# Altium schematic sheet fmc-interposer.SchDoc
size A3
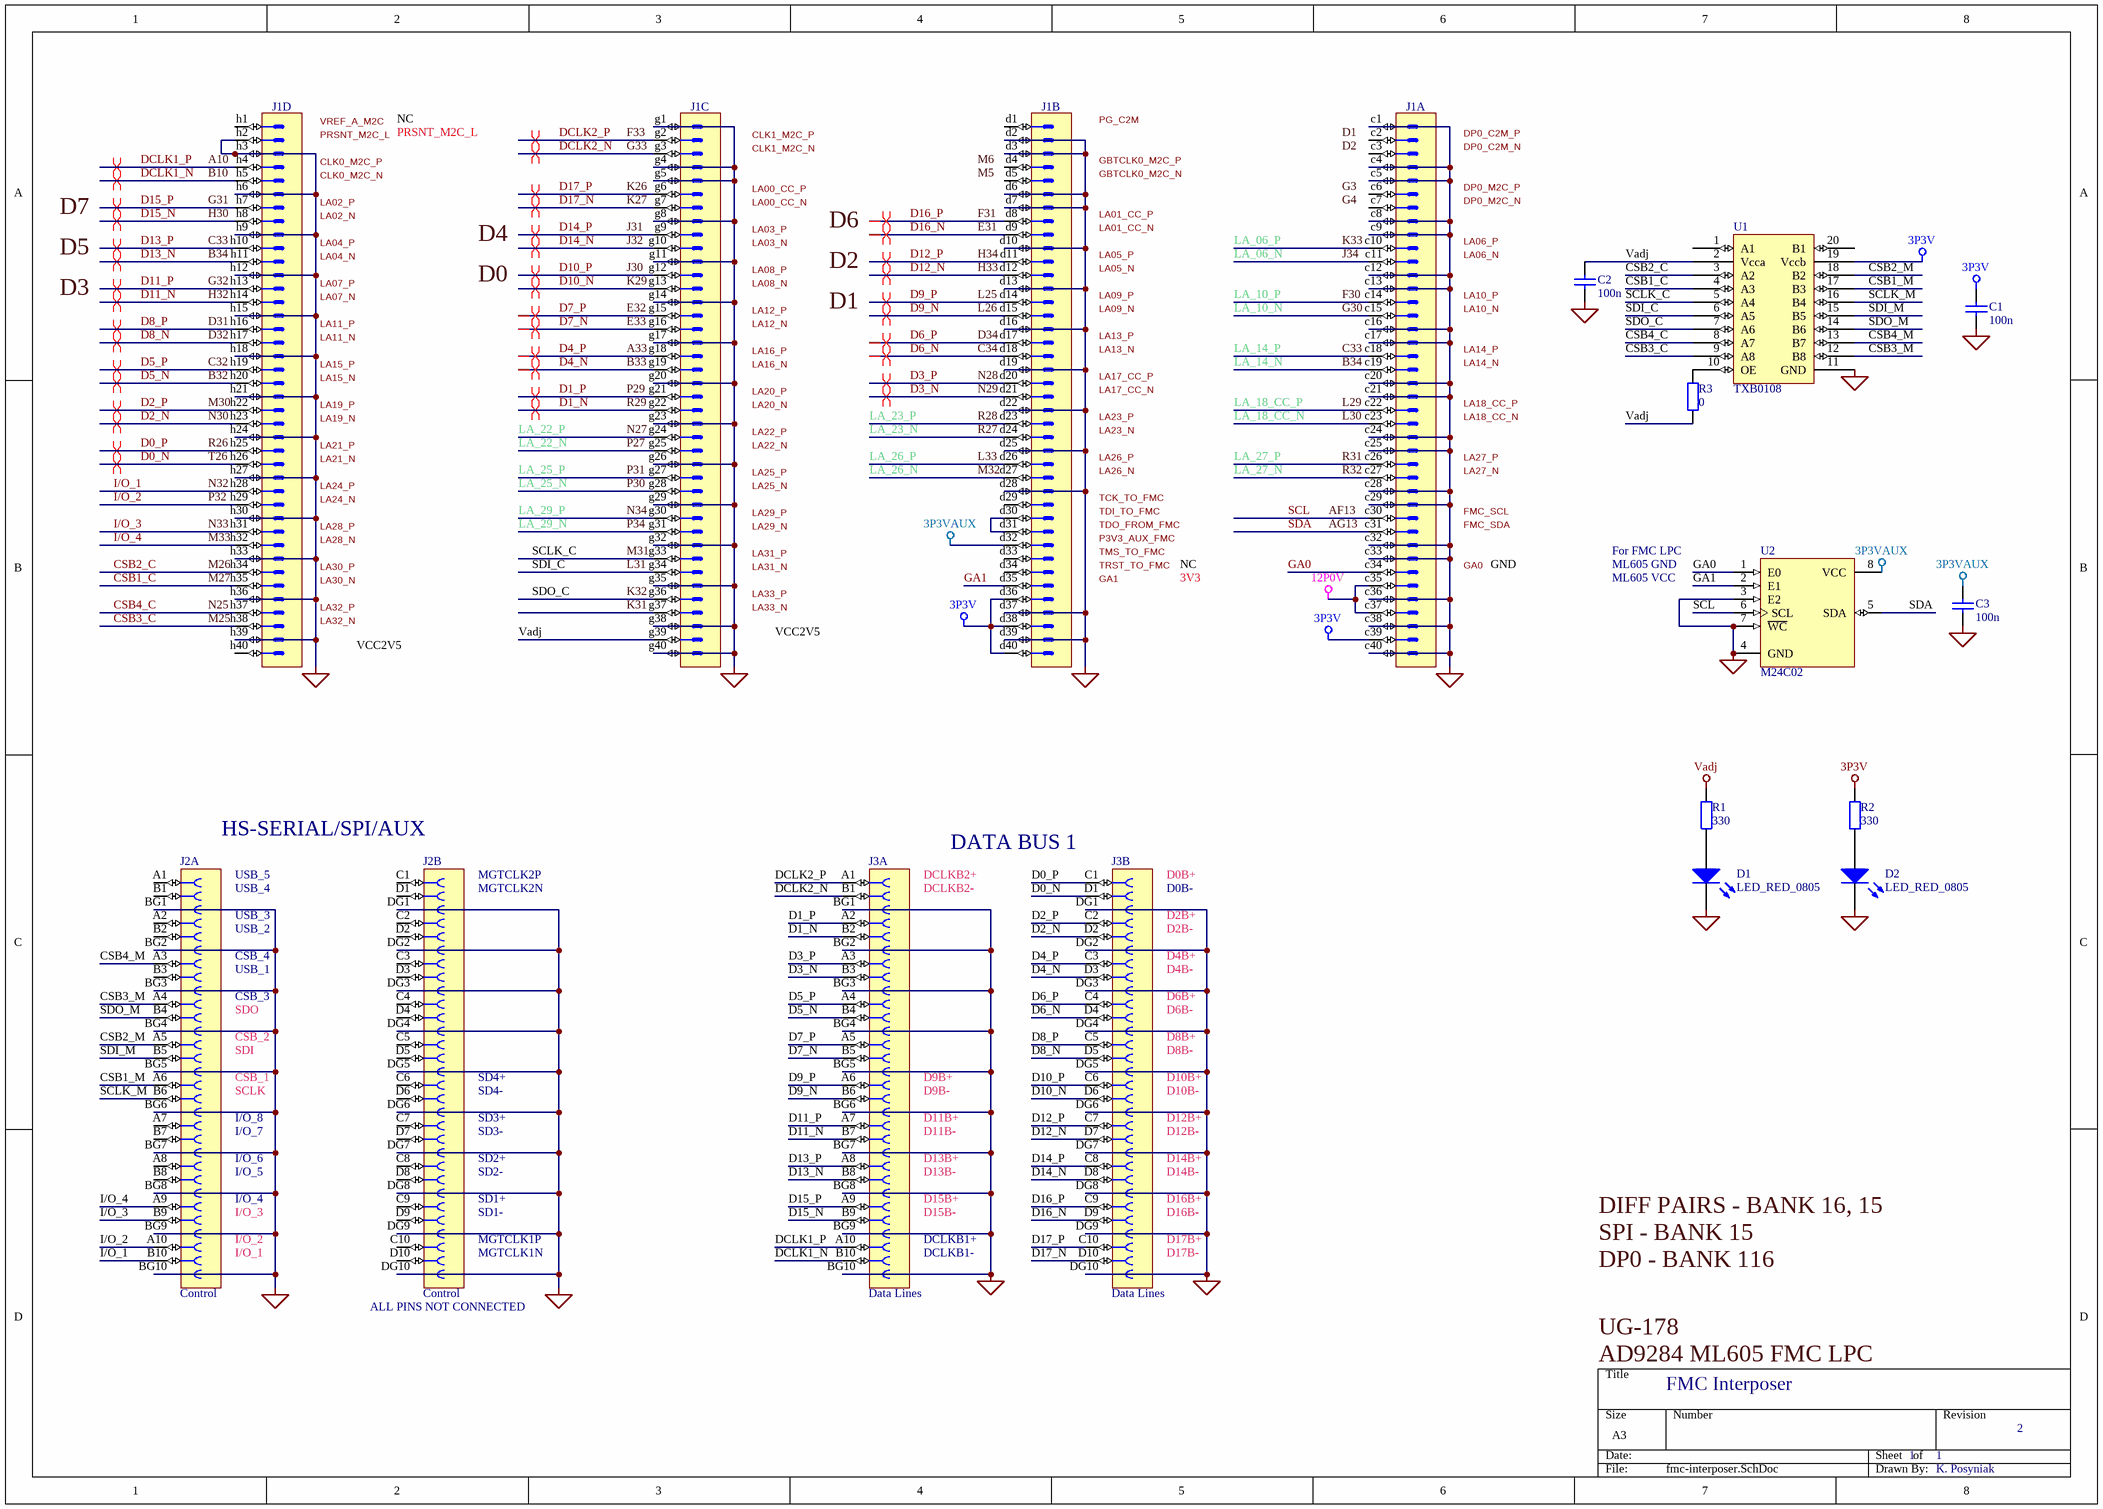
[diagram p0: fmc-interposer.SchDoc]

## Parts
C1  100n  [capc1608n]
C2  100n  [capc1608n]
C3  100n  [capc1608n]
D1  LED_RED_0805  [2.0X1.25X0.8]
D2  LED_RED_0805  [2.0X1.25X0.8]
J1  VITA 57  [SAMTEC_ASP-127797-01]  (value not drawn)  (parts A,B,C,D of 4)
J2  Control  [Analog_Conn2]  (parts A,B of 2)
J3  Data Lines  [Analog_Conn2]  (parts A,B of 2)
R1  330  [resc2012n]
R2  330  [resc2012n]
R3  0  [resc2012n]
U1  TXB0108  [TSSOP20]
U2  M24C02  [SOP8_N]

## Nets
3P3V: C1.2 J1.c39 J1.d36 J1.d38 J1.d40 R2.2 U1.19(Vccb)
3P3VAUX: C3.2 J1.d32 U2.8(VCC)
12P0V: J1.c35 J1.c37
GND: C1.1 C2.1 C3.1 D1.2(K) D2.2(K) J1.c1 J1.c4 J1.c5 J1.c8 J1.c9 J1.c12 J1.c13 J1.c16 J1.c17 J1.c20 J1.c21 J1.c24 J1.c25 J1.c28 J1.c29 J1.c32 J1.c33 J1.c36 J1.c38 J1.c40 J1.d2 J1.d3 J1.d6 J1.d7 J1.d10 J1.d13 J1.d16 J1.d19 J1.d22 J1.d25 J1.d28 J1.d37 J1.d39 J1.g1 J1.g4 J1.g5 J1.g8 J1.g11 J1.g14 J1.g17 J1.g20 J1.g23 J1.g26 J1.g29 J1.g32 J1.g35 J1.g38 J1.g40 J1.h2 J1.h3 J1.h6 J1.h9 J1.h12 J1.h15 J1.h18 J1.h21 J1.h24 J1.h27 J1.h30 J1.h33 J1.h36 J1.h39 J2.BG1 J2.BG2 J2.BG3 J2.BG4 J2.BG5 J2.BG6 J2.BG7 J2.BG8 J2.BG9 J2.BG10 J2.DG1 J2.DG2 J2.DG3 J2.DG4 J2.DG5 J2.DG6 J2.DG7 J2.DG8 J2.DG9 J2.DG10 J3.BG1 J3.BG2 J3.BG3 J3.BG4 J3.BG5 J3.BG6 J3.BG7 J3.BG8 J3.BG9 J3.BG10 J3.DG1 J3.DG2 J3.DG3 J3.DG4 J3.DG5 J3.DG6 J3.DG7 J3.DG8 J3.DG9 J3.DG10 U1.11(GND) U2.3(E2) U2.4(GND) U2.7(~{WC})
Vadj: C2.2 J1.g39 R1.2 R3.2 U1.2(Vcca)
CSB1_C: J1.h35 U1.4(A3)
CSB1_M: J2.A6 U1.17(B3)
CSB2_C: J1.h34 U1.3(A2)
CSB2_M: J2.A5 U1.18(B2)
CSB3_C: J1.h38 U1.9(A8)
CSB3_M: J2.A4 U1.12(B8)
CSB4_C: J1.h37 U1.8(A7)
CSB4_M: J2.A3 U1.13(B7)
D0_N: J1.h26 J3.D1
D0_P: J1.h25 J3.C1
D1_N: J1.g22 J3.B2
D1_P: J1.g21 J3.A2
D2_N: J1.h23 J3.D2
D2_P: J1.h22 J3.C2
D3_N: J1.d21 J3.B3
D3_P: J1.d20 J3.A3
D4_N: J1.g19 J3.D3
D4_P: J1.g18 J3.C3
D5_N: J1.h20 J3.B4
D5_P: J1.h19 J3.A4
D6_N: J1.d18 J3.D4
D6_P: J1.d17 J3.C4
D7_N: J1.g16 J3.B5
D7_P: J1.g15 J3.A5
D8_N: J1.h17 J3.D5
D8_P: J1.h16 J3.C5
D9_N: J1.d15 J3.B6
D9_P: J1.d14 J3.A6
D10_N: J1.g13 J3.D6
D10_P: J1.g12 J3.C6
D11_N: J1.h14 J3.B7
D11_P: J1.h13 J3.A7
D12_N: J1.d12 J3.D7
D12_P: J1.d11 J3.C7
D13_N: J1.h11 J3.B8
D13_P: J1.h10 J3.A8
D14_N: J1.g10 J3.D8
D14_P: J1.g9 J3.C8
D15_N: J1.h8 J3.B9
D15_P: J1.h7 J3.A9
D16_N: J1.d9 J3.D9
D16_P: J1.d8 J3.C9
D17_N: J1.g7 J3.D10
D17_P: J1.g6 J3.C10
DCLK1_N: J1.h5 J3.B10
DCLK1_P: J1.h4 J3.A10
DCLK2_N: J1.g3 J3.B1
DCLK2_P: J1.g2 J3.A1
GA0: J1.c34 U2.1(E0)
GA1: J1.d35 U2.2(E1)
I/O_1: J1.h28 J2.B10
I/O_2: J1.h29 J2.A10
I/O_3: J1.h31 J2.B9
I/O_4: J1.h32 J2.A9
LA_06_N: J1.c11
LA_06_P: J1.c10
LA_10_N: J1.c15
LA_10_P: J1.c14
LA_14_N: J1.c19
LA_14_P: J1.c18
LA_18_CC_N: J1.c23
LA_18_CC_P: J1.c22
LA_22_N: J1.g25
LA_22_P: J1.g24
LA_23_N: J1.d24
LA_23_P: J1.d23
LA_25_N: J1.g28
LA_25_P: J1.g27
LA_26_N: J1.d27
LA_26_P: J1.d26
LA_27_N: J1.c27
LA_27_P: J1.c26
LA_29_N: J1.g31
LA_29_P: J1.g30
SCL: J1.c30 U2.6(SCL)
SCLK_C: J1.g33 U1.5(A4)
SCLK_M: J2.B6 U1.16(B4)
SDA: J1.c31 U2.5(SDA)
SDI_C: J1.g34 U1.6(A5)
SDI_M: J2.B5 U1.15(B5)
SDO_C: J1.g36 U1.7(A6)
SDO_M: J2.B4 U1.14(B6)
NetD1_1: D1.1(A) R1.1
NetD2_1: D2.1(A) R2.1
NetJ1_d30: J1.d30 J1.d31
NetR3_1: R3.1 U1.10(OE)

Not connected (* = marked no-connect by the designer): J1 c2 c3 c6 c7 d1 d4 d5 d29 d33 d34 g37 h1 h40; J2 A1 A2 A7 A8 B1 B2 B3 B7 B8 C1 C2 C3 C4 C5 C6 C7 C8 C9 C10 D1 D2 D3 D4 D5 D6 D7 D8 D9 D10; U1 1(A1) 20(B1)

## Layout directives
differential pair: D0_N, D0_P, D1_N, D1_P, D2_N, D2_P, D3_N, D3_P, D4_N, D4_P, D5_N, D5_P, D6_N, D6_P, D7_N, D7_P, D8_N, D8_P, D9_N, D9_P, D10_N, D10_P, D11_N, D11_P, D12_N, D12_P, D13_N, D13_P, D14_N, D14_P, D15_N, D15_P, D16_N, D16_P, D17_N, D17_P, DCLK1_N, DCLK1_P, DCLK2_N, DCLK2_P

## Notes on the sheet
- (near J1) A10
- (near J1) B10
- VREF_A_M2C
- PRSNT_M2C_L
- CLK0_M2C_P
- CLK0_M2C_N
- NC
- (near J1) F33
- (near J1) G33
- CLK1_M2C_P
- CLK1_M2C_N
- (near J1) M5
- (near J1) M6
- PG_C2M
- GBTCLK0_M2C_P
- GBTCLK0_M2C_N
- (near J1) D1
- (near J1) D2
- DP0_C2M_P
- DP0_C2M_N
- D7
- (near J1) G31
- (near J1) H30
- (near J1) C33
- LA02_P
- LA02_N
- LA04_P
- D4
- (near J1) K26
- (near J1) K27
- (near J1) J31
- (near J1) J32
- LA00_CC_P
- LA00_CC_N
- LA03_P
- LA03_N
- D6
- (near J1) E31
- (near J1) F31
- LA01_CC_P
- LA01_CC_N
- (near J1) G3
- (near J1) G4
- (near J1) K33
- DP0_M2C_P
- DP0_M2C_N
- LA06_P
- D3
- D5
- (near J1) B34
- (near J1) G32
- (near J1) H32
- LA04_N
- LA07_P
- LA07_N
- D0
- (near J1) J30
- (near J1) K29
- (near J1) E32
- LA08_P
- LA08_N
- LA12_P
- D1
- D2
- (near J1) H33
- (near J1) H34
- (near J1) L25
- (near J1) L26
- LA05_P
- LA05_N
- LA09_P
- LA09_N
- (near J1) J34
- (near J1) F30
- (near J1) G30
- LA06_N
- LA10_P
- LA10_N
- (near J1) D31
- (near J1) D32
- (near J1) B32
- (near J1) C32
- LA11_P
- LA11_N
- LA15_P
- LA15_N
- (near J1) E33
- (near J1) A33
- (near J1) B33
- LA12_N
- LA16_P
- LA16_N
- (near J1) D34
- (near J1) C34
- (near J1) N28
- LA13_P
- LA13_N
- LA17_CC_P
- LA14_P
- LA14_N
- (near J1) M30
- (near J1) N30
- (near J1) R26
- LA19_P
- LA19_N
- LA21_P
- (near J1) P29
- (near J1) R29
- (near J1) N27
- (near J1) P27
- LA20_P
- LA20_N
- LA22_P
- LA22_N
- (near J1) N29
- (near J1) R27
- (near J1) R28
- LA17_CC_N
- LA23_P
- LA23_N
- (near J1) L29
- (near J1) L30
- LA18_CC_P
- LA18_CC_N
- (near J1) T26
- (near J1) N32
- (near J1) P32
- LA21_N
- LA24_P
- LA24_N
- (near J1) P30
- (near J1) P31
- (near J1) N34
- LA25_P
- LA25_N
- LA29_P
- (near J1) L33
- (near J1) M32
- LA26_P
- LA26_N
- TCK_TO_FMC
- TDI_TO_FMC
- (near J1) AF13
- (near J1) R31
- (near J1) R32
- LA27_P
- LA27_N
- FMC_SCL
- (near J1) N33
- (near J1) M33
- (near J1) M26
- (near J1) M27
- LA28_P
- LA28_N
- LA30_P
- LA30_N
- (near J1) P34
- (near J1) M31
- (near J1) L31
- LA29_N
- LA31_P
- LA31_N
- TDO_FROM_FMC
- P3V3_AUX_FMC
- TMS_TO_FMC
- TRST_TO_FMC
- GA1
- 3V3
- (near J1) AG13
- FMC_SDA
- GA0
- GND
- ML605 GND
- ML605 VCC
- For FMC LPC
- (near J1) N25
- (near J1) M25
- LA32_P
- LA32_N
- VCC2V5
- (near J1) K31
- (near J1) K32
- LA33_P
- LA33_N
- (near J2) HS-SERIAL/SPI/AUX
- DATA BUS 1
- USB_3
- USB_4
- USB_5
- MGTCLK2N
- MGTCLK2P
- DCLKB2+
- DCLKB2-
- D0B+
- D2B+
- D0B-
- USB_1
- USB_2
- CSB_4
- D4B+
- D2B-
- D4B-
- SDO
- SDI
- CSB_2
- CSB_3
- D6B+
- D8B+
- D8B-
- D6B-
- SCLK
- CSB_1
- I/O_8
- SD3+
- SD4+
- SD4-
- D11B+
- D9B+
- D9B-
- D10B+
- D10B-
- D12B+
- I/O_5
- I/O_6
- I/O_7
- SD2+
- SD2-
- SD3-
- D13B-
- D13B+
- D11B-
- D12B-
- D14B+
- D14B-
- I/O_1
- I/O_2
- I/O_3
- I/O_4
- MGTCLK1P
- MGTCLK1N
- SD1+
- SD1-
- DCLKB1-
- DCLKB1+
- D15B-
- D15B+
- D16B+
- D16B-
- D17B+
- D17B-
- DIFF PAIRS - BANK 16, 15
- SPI - BANK 15
- (near J2) ALL PINS NOT CONNECTED
- DP0 - BANK 116
- UG-178
- AD9284 ML605 FMC LPC
- FMC Interposer
- 1
- 2
- K. Posyniak

## Library data of the parts
C1-C3 = Cap: Capacitor; Published: 8-Jun-2000; LatestRevisionDate: 17-Jul-2002; LatestRevisionNote: Re-released for DXP Platform.; PackageReference: RAD-0.3; Publisher: Altium Limited; PackageDescription: Radial Cap, Thru-Hole; 2 Leads; 0.3 in Pin Spacing
D1 D2 = HSMB-C170: Blue Surface Mount Chip LED, Blue; LuminousIntensity: 1.6mcd (Minimum).; PCB_Layout: Complies with manufacturer's recommendation.; Published: 11-Dec-2002; DatasheetDocument: 26-Feb-2002; PackageDocument: 29-Oct-2001; PackageReference: 2.0X1.25X0.8; Publisher: Altium Limited; LED_Colour: Blue; ComponentLink1Description: Manufacturer Link; ComponentLink1URL: http://www.agilent.com/; ComponentLink2Description: Datasheet; ComponentLink2URL: http://cp.literature.agilent.com/litweb/pdf/5988-5211EN.pdf
J1 = Connector VITA 57 160 Male (cdgh): Connector VITA 57, 160 Male contacts in 4 row cdgh; Part Description: 160 contacts (4 rows cdgh) Surface Mount Male Connector, VITA 57 (MC-LPC-10L); Manufacturer: SAMTEC; Manufacturer Part Number: ASP-127797-01; Part Number: SAMTEC_ASP-127797-01; Component Kind: Standard; Component Type: Standard; Pin Count: 160; Family: VITA 57; Mounted: Yes; Socket: No; SMD: Yes; Status: None; ComponentHeight: 6.1mm; HelpURL: \\cern.ch\dfs\Applications\Altium\Datasheets\SAMTEC_ASP-127797-01.pdf; Author: CERN DEM JLC; CreateDate: 24/09/2009; LatestRevisionDate: 24/09/2009; Table: SAMTEC
J2 J3 = Analog_Conn2
R1-R3 = RES2: Resistor; Published: 8-Jun-2000; LatestRevisionDate: 17-Jul-2002; LatestRevisionNote: Re-released for DXP Platform.; PackageReference: AXIAL-0.4; Publisher: Altium Limited; PackageDescription: Axial Device, Thru-Hole; 2 Leads; 0.4 in Pin Spacing
U2 = M24C02MN6: 2Kbit Serial I˛C Bus EEPROM; Published: 24-Aug-2001; LatestRevisionDate: 13-Apr-2006; LatestRevisionNote: IPC-7351 Footprint Added.; DatasheetVersion: Sep-1999; PackageVersion: Jul-1999; PackageReference: SOP8; Publisher: Altium Limited; PackageDescription: 8-Pin Small Outline Integrated Circuit 1.27 mm Pitch; ComponentLink1Description: Manufacturer Link; ComponentLink1URL: http://www.st.com/; ComponentLink2Description: Datasheet; ComponentLink2URL: http://www.st.com/stonline/products/literature/ds/5067/m24c01-r.pdf